# Altium project PRP_CreamPower_PCB.PrjPCB
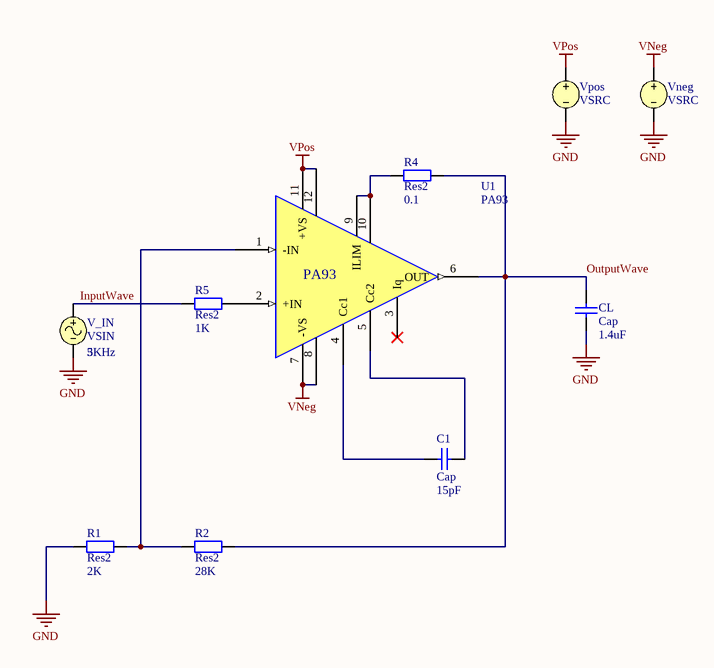
[diagram p0: PA93_Periphery.SchDoc]
1 sheet, 10 parts. Net scope: global (net labels, ports and power ports of the same name join across sheets).

## Sheet PA93_Periphery.SchDoc
size A3 portrait

### Parts
C1  Cap  value 15pF  [RAD-0.3]
CL  Cap  value 1.4uF  [RAD-0.3]
R1  Res2  value 2K  [AXIAL-0.4]
R2  Res2  value 28K  [AXIAL-0.4]
R4  Res2  value 0.1  [AXIAL-0.4]
R5  Res2  value 1K  [AXIAL-0.4]
U1  PA93
V_IN  VSIN  AC Magnitude: 5  Frequency: 3KHz
Vneg  VSRC
Vpos  VSRC

### Nets
GND: CL.1 R1.1 V_IN.2 Vneg.2 Vpos.2
VNeg: U1.7(-VS) U1.8(-VS) Vneg.1
VPos: U1.11(+VS) U1.12(+VS) Vpos.1
InputWave: R5.1 V_IN.1
OutputWave: CL.2 R2.2 R4.2 U1.6(OUT)
NetC1_1: C1.1 U1.4(Cc1)
NetC1_2: C1.2 U1.5(Cc2)
NetR1_2: R1.2 R2.1 U1.1(-IN)
NetR4_1: R4.1 U1.9(ILIM) U1.10(ILIM)
NetR5_2: R5.2 U1.2(+IN)

Not connected (* = marked no-connect by the designer): U1 3(Iq)*

### Notes on the sheet
- Title
- Size:
- Date:
- A3
- Number:
- Time:
- Revision:
- Sheet
- of
- File:

### Library data of the parts
C1 CL = Cap: Capacitor; Published: 8-Jun-2000; LatestRevisionDate: 17-Jul-2002; LatestRevisionNote: Re-released for DXP Platform.; PackageReference: RAD-0.3; Publisher: Altium Limited; PackageDescription: Radial Cap, Thru-Hole; 2 Leads; 0.3 in Pin Spacing
R1 R2 R4 R5 = Res2: Resistor; Published: 8-Jun-2000; LatestRevisionDate: 17-Jul-2002; LatestRevisionNote: Re-released for DXP Platform.; PackageReference: AXIAL-0.4; Publisher: Altium Limited; PackageDescription: Axial Device, Thru-Hole; 2 Leads; 0.4 in Pin Spacing
V_IN = VSIN: Sinusoidal Voltage Source; Note: PCB Footprint - Not required; Published: 8-Jun-2000; LatestRevisionDate: 15-Nov-2004; LatestRevisionNote: Corrected Netlist.; PackageReference: Not Applicable; Publisher: Altium Limited; Offset: 5; Amplitude: 5
Vneg = VSRC: Voltage Source; Note: PCB Footprint - Not required; Value: -30; Published: 8-Jun-2000; LatestRevisionDate: 17-Jul-2002; LatestRevisionNote: Re-released for DXP Platform.; PackageReference: Not Applicable; Publisher: Altium Limited
Vpos = VSRC: Voltage Source; Note: PCB Footprint - Not required; Value: +160; Published: 8-Jun-2000; LatestRevisionDate: 17-Jul-2002; LatestRevisionNote: Re-released for DXP Platform.; PackageReference: Not Applicable; Publisher: Altium Limited